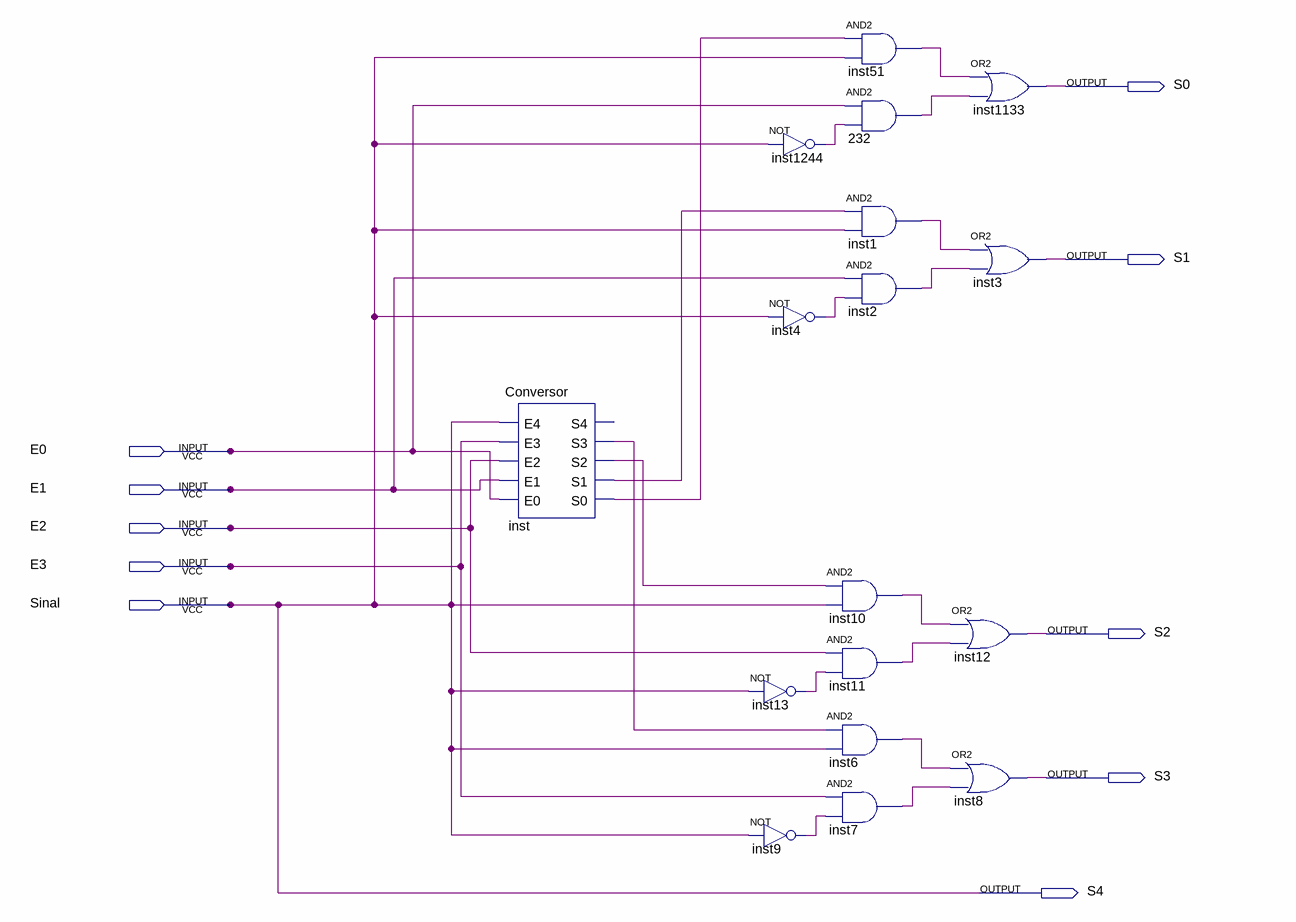
[diagram p0: schematic sheet]
// Quartus schematic Conversor_Multiplex(1).bdf as structural Verilog: 17 symbols, 10 pins
module \Conversor_Multiplex(1)  (
  input  E0,
  input  E1,
  input  E2,
  input  E3,
  input  Sinal,
  output S0,
  output S1,
  output S2,
  output S3,
  output S4
);

  wire inst1_out, inst2_out, inst4_out, inst6_out, inst7_out, inst9_out, inst10_out, inst11_out, inst13_out,
       inst51_out, inst1244_out, inst_s0, inst_s1, inst_s2, inst_s3, n232_out;

  Conversor inst (
    .E4(Sinal), .E3(E3), .E2(E2), .E1(E1), .E0(E0), .S3(inst_s3), .S2(inst_s2), .S1(inst_s1), .S0(inst_s0));  // open: S4
  not inst1244 (inst1244_out, Sinal);
  not inst4 (inst4_out, Sinal);
  not inst13 (inst13_out, Sinal);
  not inst9 (inst9_out, Sinal);
  and inst51 (inst51_out, inst_s0, Sinal);
  and u_232 (n232_out, E0, inst1244_out);
  and inst1 (inst1_out, inst_s1, Sinal);
  and inst2 (inst2_out, E1, inst4_out);
  and inst10 (inst10_out, inst_s2, Sinal);
  and inst11 (inst11_out, E2, inst13_out);
  and inst6 (inst6_out, inst_s3, Sinal);
  and inst7 (inst7_out, E3, inst9_out);
  or inst1133 (S0, inst51_out, n232_out);
  or inst3 (S1, inst1_out, inst2_out);
  or inst12 (S2, inst10_out, inst11_out);
  or inst8 (S3, inst6_out, inst7_out);

  assign S4 = Sinal;
endmodule
